# Altium schematic sheet Arduino Demo Shield.SchDoc
size A; SheetNumber: 1; SheetTotal: 1
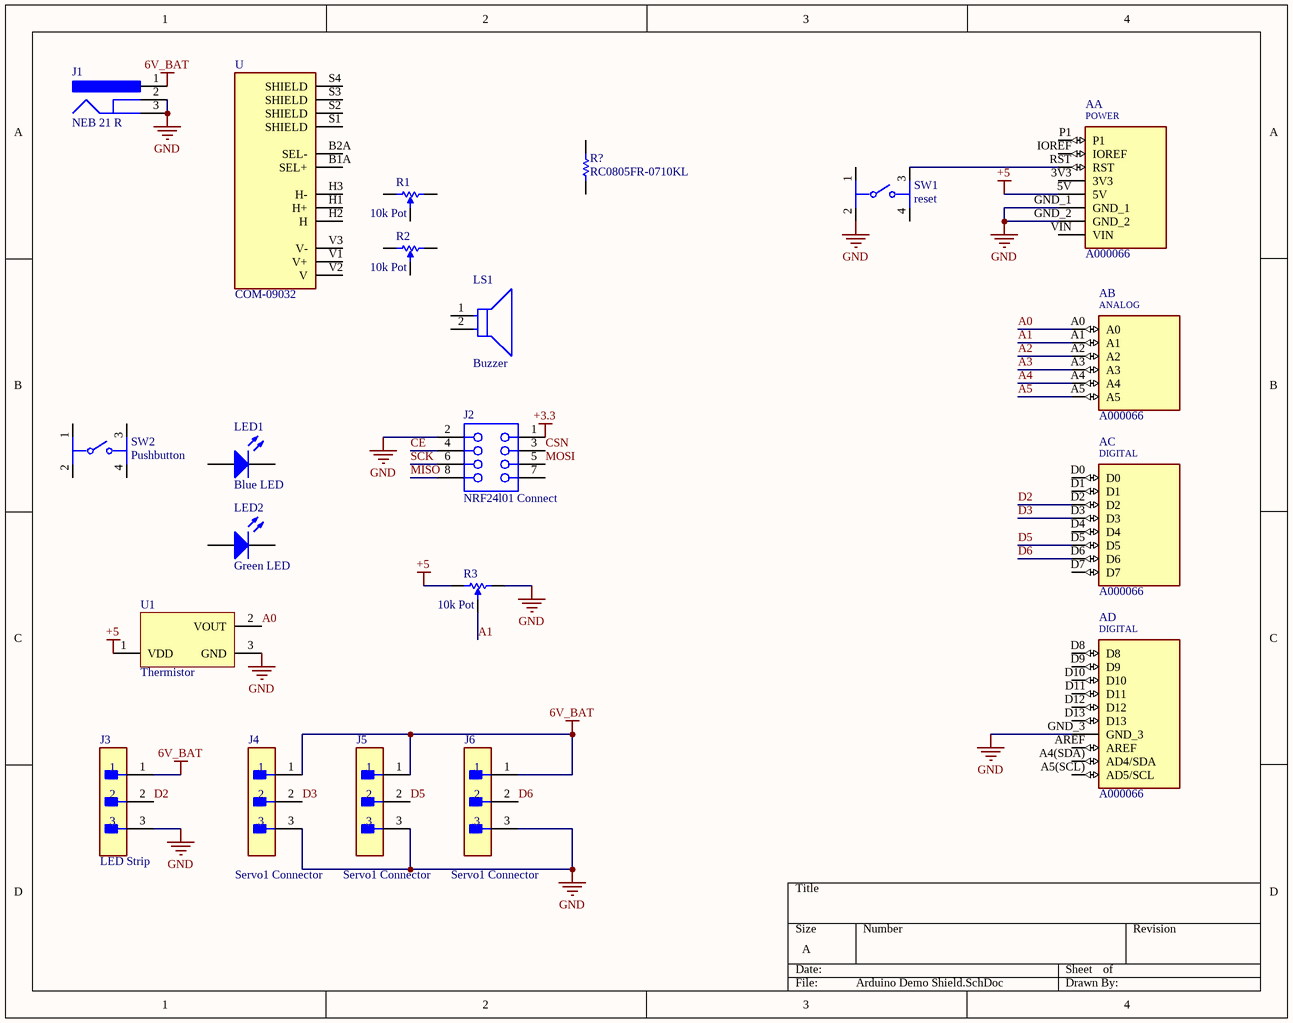
[diagram p0: Arduino Demo Shield.SchDoc]

## Parts
A  A000066  [ARDUINO_A000066]  (parts A,B,C,D of 4)
J1  NEB 21 R  [LUMB-NEB21R_V]
J2  NRF24l01 Connect  [SMTC-SSW-104-01-X-D]
J3  LED Strip  [FP-22-28-4030-MFG]
J4  Servo1 Connector  [FP-22-28-4030-MFG]
J5  Servo1 Connector  [FP-22-28-4030-MFG]
J6  Servo1 Connector  [FP-22-28-4030-MFG]
LED1  Blue LED  [0805_A]
LED2  Green LED  [0805_A]
LS1  Buzzer  [FP-PKM13EPYH4002-B0-MFG]
R1  10k Pot  [RES-POT-3]
R2  10k Pot  [RES-POT-3]
R3  10k Pot  [RES-POT-3]
R?  RC0805FR-0710KL  [RESC2013X60X35NL10T20]
SW1  reset  [FP-1825910-2-0]
SW2  Pushbutton  [FP-1825910-2-0]
U  COM-09032  [XDCR_COM-09032]
U1  Thermistor  [SOT-23-TT3_M]

## Nets
6V_BAT: J1.1 J3.1 J4.1 J5.1 J6.1
+3.3: J2.1
+5: A.5V R3.1 U1.1(VDD)
GND: A.GND_1 A.GND_2 A.GND_3 J1.2 J1.3 J2.2 J3.3 J4.3 J5.3 J6.3 R3.3 SW1.2 U1.3(GND)
A0: A.A0 U1.2(VOUT)
A1: A.A1 R3.2
A2: A.A2
A3: A.A3
A4: A.A4
A5: A.A5
CE: J2.4
CSN: J2.3
D2: A.D2 J3.2
D3: A.D3 J4.2
D5: A.D5 J5.2
D6: A.D6 J6.2
MISO: J2.8
MOSI: J2.5
SCK: J2.6
NetA_RST: A.RST SW1.3

Not connected (* = marked no-connect by the designer): A 3V3 A4(SDA)(AD4/SDA) A5(SCL)(AD5/SCL) AREF D0 D1 D4 D7 D8 D9 D10 D11 D12 D13 IOREF P1 VIN; J2 7; LED1 1(K) 2(A); LED2 1(K) 2(A); LS1 1 2; R1 1 2 3; R2 1 2 3; R? 1 2; SW1 1 4; SW2 1 2 3 4; U B1A(SEL+) B2A(SEL-) H1(H+) H2(H) H3(H-) S1(SHIELD) S2(SHIELD) S3(SHIELD) S4(SHIELD) V1(V+) V2(V) V3(V-)

## Notes on the sheet
- (in symbol A000066, part A) POWER
- (in symbol A000066, part B) ANALOG
- (in symbol A000066, part C) DIGITAL
- (in symbol A000066, part D) DIGITAL

## Library data of the parts
A = A000066: ATmega328P Arduino Uno R3 AVRÂ® ATmega AVR MCU 8-Bit Embedded Evaluation Board; pin to pad: A4(SDA)>A4(SDA; Value: *; Package: None; MF: Arduino; Price: None; MP: A000066; Availability: Unavailable; SnapEDA_Link: https://www.snapeda.com/parts/A000066/Arduino/view-part/557638/?ref=snap
J1 = CMP-2000-06841-1: Jack Socket, Body 14.5 x 9 mm, Height 11 mm, -20 to 70 degC, 3-Pin THD, RoHS, Bulk; Manufacturer: Lumberg; Body Orientation: RightAngle; Voltage Rating: 12Vdc; Current Rating: 3A; Maximum Operating Temperature: +70°C; Mounting Technology: ThroughHole; Termination Method: Solder; Package Description: 3-Pin Through Hole Device, Body 14.5 x 9 mm, Height 11 mm; Datasheet URL: https://datasheet.ciiva.com/11720/0900766b805694d6-11720273.pdf; Datasheet Version: 12/2004; Package Reference: NEB21R; Manufacturer URL: http://www.lumberg.com/; Plug/Socket: Socket; Mounting Type: ThroughHole; Minimum Operating Temperature: -20°C
J2 = CMP-1023-00339-1: SQ Post Socket, Through-hole, Vertical, -55 to 105 degC, 2.54mm Pitch, 8-Pin, Female, RoHS; PartNumber: SSW-104-01-T-D; Manufacturer: Samtec; ComponentLink1Description: Manufacturer URL; ComponentLink3Description: Package Specification; ComponentLink2Description: Datasheet; DatasheetVersion: F-214; PackageDescription: Assembly, Socket Strip .016 X .031 Tail; ComponentLink3URL: http://www.samtec.com/documents/webfiles/cpdf/SSW-1XX-XX-XXX-X-XX-XXX-XX-MKT.pdf; PackageReference: SSW-104-01-X-D; PackageVersion: CA, 6/1987; ComponentLink1URL: http://www.samtec.com; ComponentLink2URL: http://www.samtec.com/documents/webfiles/pdf/SSW_TH.PDF; Temperature Range: -55 to 105 degC; Orientation: Vertical; RoHS: True; Mounting Technology: Through-hole; Pitch: 2.54 mm
J3-J6 = CMP-04776-000098-1: CONN HEADER VERT 3POS 2.54MM; Manufacturer: Molex; Conn Orientation: Vertical; Conn Gender: Male; Current Rating: 4A; Voltage Rating: 500V; Number Of Contacts: 3; Category: Conn; Number Of Rows: 1; Manufacturer Part Number: 22-28-4030; RoHS: TRUE; Package: 22-28-4030; Footprint Url: https://www.molex.com/pdm_docs/sd/022284030_sd.pdf; ComponentLink2Description: Datasheet; Device Class L2: Headers and Wire Housings; Automotive: No; Temperature Range Low: -40°C; Digikey Description: CONN HEADER VERT 3POS 2.54MM; Mouser Description: Headers & Wire Housings 3P VERT HEADER Sn; Contact Material: Gold,Nickel; Pitch: 2.54mm; Device Class L1: Connectors; Lead Free: Yes; Device Class L3: unset; Temperature Range High: +80°C; Octopart: https://octopart.com/0022284030-molex-10476094; ComponentLink2URL: https://www.molex.com/webdocs/datasheets/pdf/en-us/0022284030_PCB_HEADERS.pdf; Height: 8.88mm; Temperature: -40°C to +80°C
LED1 = CMP-1426-00008-1: SMD mono-color Chip LED, WL-SMCW, Blue; Manufacturer: Wuerth Elektronik; PartNumber: 150080BS75000; Color: Blue; ComponentLink2URL: http://katalog.we-online.com/led/datasheet/150080BS75000.pdf; ComponentLink1URL: http://www.we-online.com; ComponentLink2Description: Datasheet; PackageReference: 0805_A; ComponentLink1Description: Manufacturer URL
LED2 = CMP-1426-00007-1: SMD mono-color Chip LED, WL-SMCW, Green; PartNumber: 150080GS75000; Manufacturer: Wuerth Elektronik; PackageReference: 0805_A; Color: Green; ComponentLink2URL: http://katalog.we-online.com/led/datasheet/150080GS75000.pdf; ComponentLink1URL: http://www.we-online.com; ComponentLink1Description: Manufacturer URL; ComponentLink2Description: Datasheet
LS1 = CMP-06202-000007-1: AUDIO PIEZO TRANSDUCER 30V TH; Self Resonant Frequency: 4kHz; Washable: No; Voltage Rating: 3V; Termination: Solder; Radiation Hardening: No; Diameter: 12.6mm; Max Supply Voltage: 30V; Lead Free: Lead Free; Packaging: Bulk; Mount: Through Hole; Max Operating Temperature: 85°C; Frequency: 4kHz; Max Frequency: 4kHz; REACH SVHC: No SVHC; Nominal Input Voltage: 3V; Package Quantity: 1980; Height: 6.9mm; Min Operating Temperature: -40°C; Voltage Rating (DC): 30V
R1-R3 = CMP-2000-06871-1: 9 mm Rotary Potentiometer, Insulated Shaft, Conductive Plastic Element, 10 KOhm, -20 to 70 degC, 3-Pin THD, RoHS, Tray; Manufacturer: BI Technologies; Actuator Type: Knurled; Power Rating: 0.03W; Tolerance: ±20%; Actuator Diameter: 0.236"(6.00mm); Other Names: 987-1277P090S14T20BR10K; Actuator Length: 0.787"(20.00mm); Number of Gangs: 1; Online Catalog: P090Series; Power (Watts): 0.03W,1/32W; Built in Switch: Detent; Adjustment Type: TopAdjustment; Rotation: 280°; Package Description: POT, 3-Leads, Body 9.8 x 12.5 mm, Pitch 2.5 mm; Bushing Thread: -; Package Reference: POT-3; Datasheet URL: http://www.bitechnologies.com/pdfs/p090.pdf; Packaging: Tray; Manufacturer URL: http://www.bi-technologies.net/; Package URL: http://www.bitechnologies.com/pdfs/p090.pdf; Mounting Technology: ThroughHole; Datasheet Version: 07/2008; Taper: Linear; Resistive Material: ConductivePlastic; Mounting Type: ThroughHole; Temperature Coefficient: -; Standard Package: 1; Category: Potentiometers,VariableResistors; Resistance (Ohms): 10k; Family: RotaryPotentiometers,Rheostats; Termination Style: PCBPins,BoardLocks; Series: P090; Number of Turns: 1
R? = CMP-1659-00013-4: Chip Resistor, 10 KOhm, +/- 1%, 0.125 W, -55 to 155 degC, 0805 (2012 Metric), RoHS, Tape and Reel; Manufacturer: Yageo; Voltage Rating: 150 V; Mount: Surface Mount; ComponentLink1Description: Manufacturer URL; ComponentLink2URL: http://www.yageo.com/documents/recent/PYu-RC_Group_51_RoHS_L_04.pdf; Pins: 2; Length: 2 mm; Min Operating Temperature: -55 degC; Height: 0.5 mm; Mounting Technology: Surface Mount; RoHSCompliant: true; REACH SVHC: No SVHC; ComponentLink1URL: http://www.yageo.com/; Max Operating Temperature: 155 degC; PackageReference: 0805; DatasheetVersion: Rev. 4, 02/2016; Package Quantity: 5000; Packaging: Tape and Reel; ComponentLink2Description: Datasheet; PackageDescription: 2-Pin Surface Mounted Device, Body 2 x 1.25 mm
SW1 SW2 = CMP-03407-000004-1: SWITCH TACTILE SPST-NO 0.05A 24V; Manufacturer: TE; Manufacturer Part Number: 1825910-2; Contact Current Rating: 50mA; Operating Force: 160gf; Contact Resistance: 100mΩ; Electromechanical Life: 100000Cycles; Package: 0; ComponentLink2Description: Datasheet; Digikey Description: SWITCH TACTILE SPST-NO 0.05A 24V; Octopart: https://octopart.com/1825910-2-te+connectivity-42270502; Temperature Range Low: -35°C; Temperature Range High: +85°C; Lead Free: Yes; Device Class L2: Switches; Automotive: No; Temperature: -35°C to +85°C; Device Class L1: Electromechanical; Category: Switch; ComponentLink2URL: https://www.te.com/commerce/DocumentDelivery/DDEController?Action=showdoc&DocId=Customer+Drawing%7F1825910%7FC10%7Fpdf%7FEnglish%7FENG_CD_1825910_C10.pdf%7F1825910-2; Mount: Through Hole; RoHS: TRUE; Height: 4.6mm; Device Class L3: Tactile Switches; Voltage Rating Dc: 24V; Throw Configuration: SPST-NO
U = COM-09032: Joystick, 2 - Axis Analog _Resistive_ Output; MF: SparkFun Electronics; SnapEDA_Link: https://www.snapeda.com/parts/COM-09032/SparkFun%20Electronics/view-part/888157/?ref=snap; Availability: Unavailable; Value: *; Price: None; MP: COM-09032; Package: SparkFun Electronics
U1 = CMP-0192-00221-1: Low-Power Linear Active Thermistor IC, 3-Pin SOT-23, Extended Temperature, Tape and Reel; PackageDescription: 3-Lead Plastic Small Outline Transistor (TT) [SOT-23]; DatasheetVersion: revE, Apr-2009; Code_IPC: SOT23-3; PackageVersion: revBB, Aug-2009; PackageReference: SOT-23-TT3